# EAGLE design WS2801-Breakout-v11 (EAGLE 5.11)
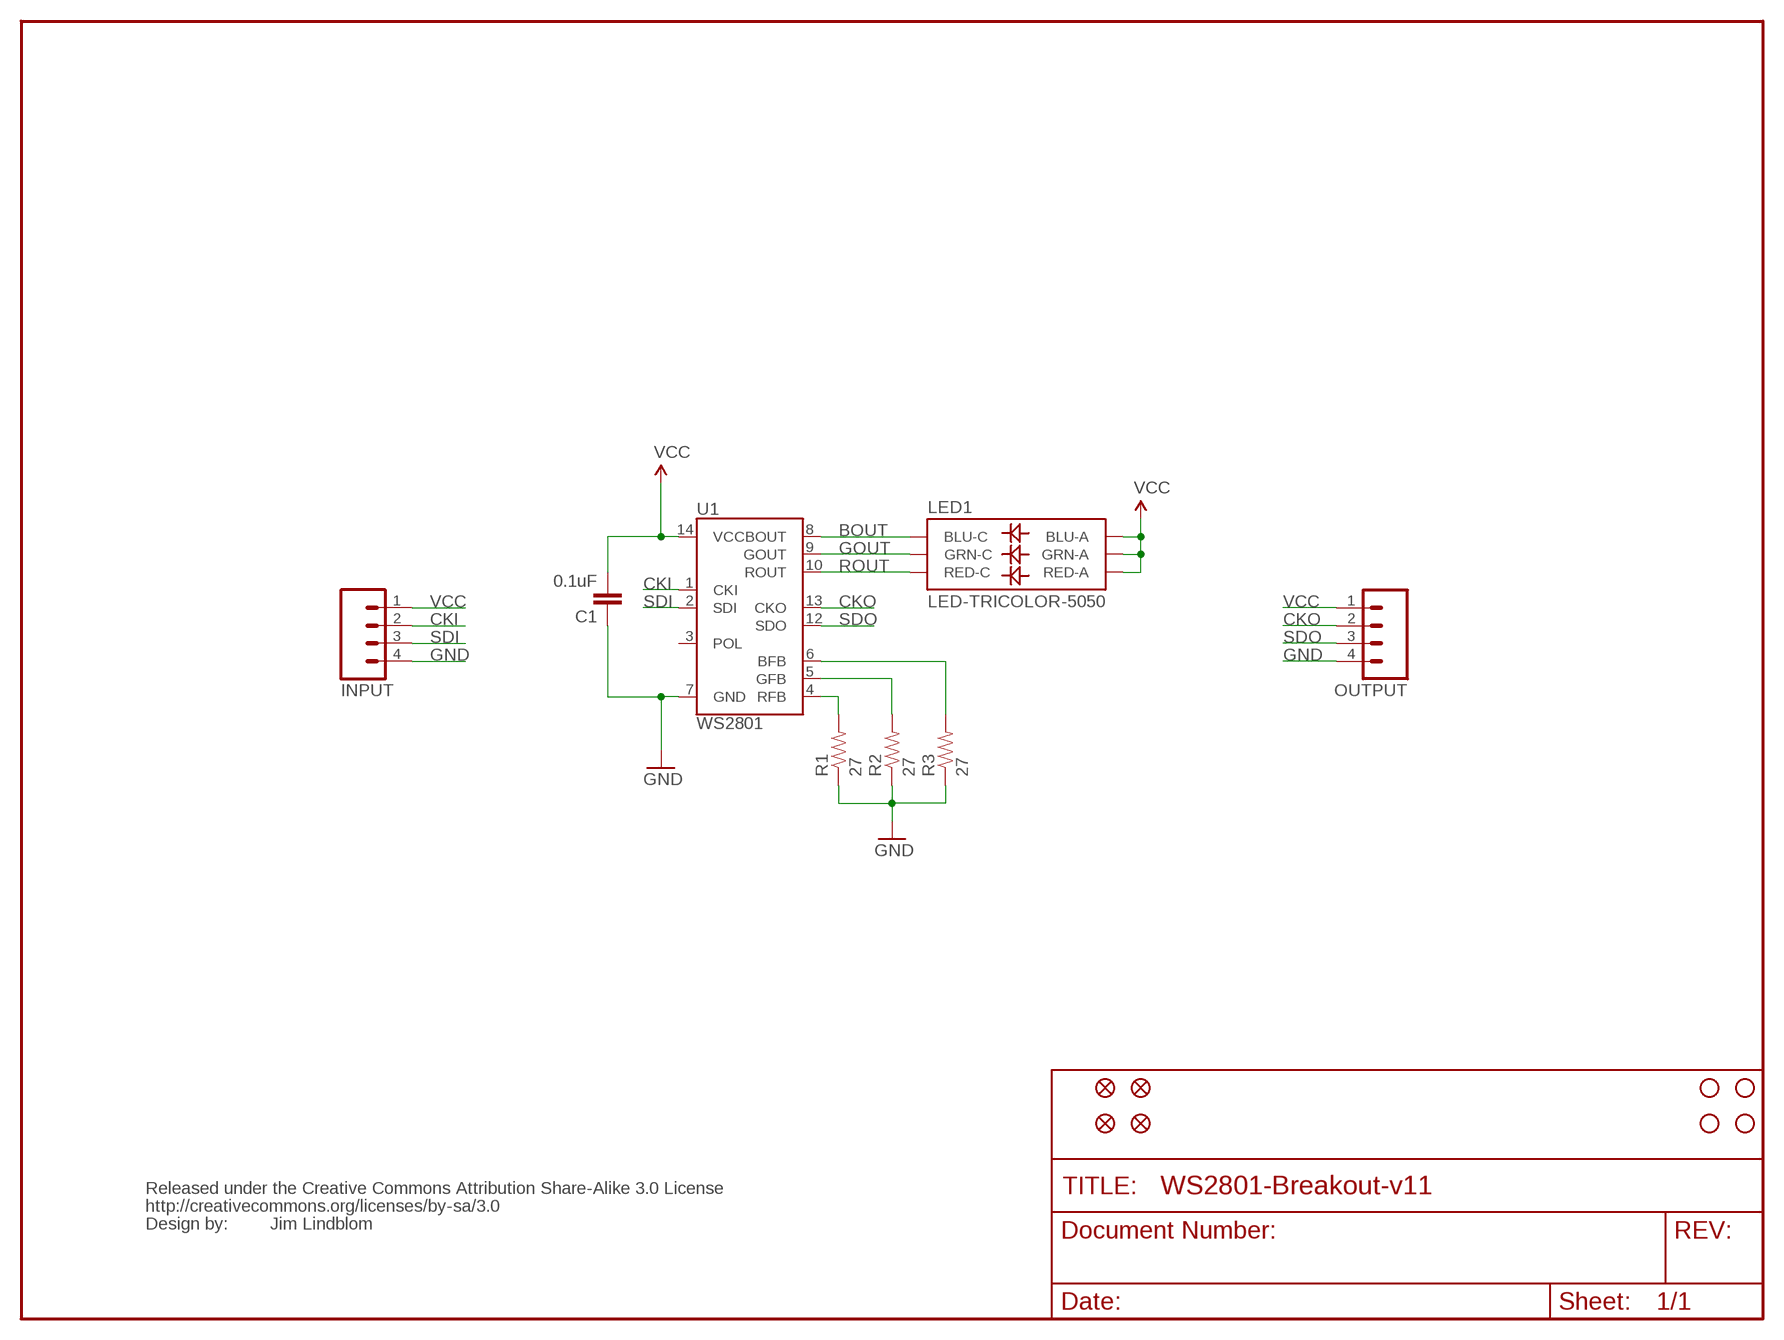
[diagram p0: schematic, sheet 1]

## Parts
C1  0.1uF  CAP0402-CAP  [0402-CAP]
INPUT  M04PTH  [1X04]
JP1  STAND-OFF  [STAND-OFF]
JP2  STAND-OFF  [STAND-OFF]
JP4  STAND-OFF  [STAND-OFF]
JP5  STAND-OFF  [STAND-OFF]
JP6  FIDUCIAL1X2  [FIDUCIAL-1X2]
JP7  FIDUCIAL1X2  [FIDUCIAL-1X2]
JP8  FIDUCIAL1X2  [FIDUCIAL-1X2]
JP9  FIDUCIAL1X2  [FIDUCIAL-1X2]
LED1  LED-TRICOLOR-5050  [LED-TRICOLOR-5050]
OUTPUT  M04PTH  [1X04]
R1  27  RESISTOR0402-RES  [0402-RES]
R2  27  RESISTOR0402-RES  [0402-RES]
R3  27  RESISTOR0402-RES  [0402-RES]
U1  WS2801  [SOP-14]
U$1  CREATIVE_COMMONS  [CREATIVE_COMMONS]

## Nets
BFB: R3.2 U1.6(BFB)
BOUT: LED1.4(BLU-C) U1.8(BOUT)
CKI: INPUT.2 U1.1(CKI)
CKO: OUTPUT.2 U1.13(CKO)
GFB: R2.2 U1.5(GFB)
GND: C1.1 INPUT.4 OUTPUT.4 R1.1 R2.1 R3.1 U1.7(GND)
GOUT: LED1.6(GRN-C) U1.9(GOUT)
RFB: R1.2 U1.4(RFB)
ROUT: LED1.5(RED-C) U1.10(ROUT)
SDI: INPUT.3 U1.2(SDI)
SDO: OUTPUT.3 U1.12(SDO)
VCC: C1.2 INPUT.1 LED1.1(GRN-A) LED1.2(RED-A) LED1.3(BLU-A) OUTPUT.1 U1.14(VCC)
Unconnected: U1.3(POL)

## Notes on the sheet
- Jim Lindblom

## Library data of the parts
C1 = SparkFun:CAP: Capacitor Standard 0603 ceramic capacitor, and 0.1" leaded capacitor.
INPUT OUTPUT = SparkFun:M04: Header 4 Standard 4-pin 0.1" header. Use with straight break away headers (SKU : PRT-00116), right angle break away headers (PRT-00553), swiss pins (PRT-00743), machine pins (PRT-00117), and female headers (PRT-00115). Molex polarized connector foot print use with SKU : PRT-08231 with associated crimp pins and housings. 1MM SMD Version SKU: PRT-10208
JP1 JP2 JP4 JP5 = SparkFun:STAND-OFF: Stand Off This is the mechanical footprint for a #4 phillips button head screw. Use the keepout ring to avoid running the screw head into surrounding components. SKU : PRT-00447
JP6-JP9 = SparkFun:FIDUCIAL: Fiducial Alignment Points Various fiducial points for machine vision alignment.
LED1 = SparkFun:LED-TRICOLOR-5050
R1-R3 = SparkFun:RESISTOR: Resistor Basic schematic elements and footprints for 0603, 1206, and PTH resistors.
U1 = SparkFun:WS2801: WS2801 3 Channel Constant Current LED Driver with programmable PWM outputs. Datasheet: http://www.sparkfun.com/datasheets/Components/LED/WS2801.pdf
U$1 = SparkFun:CREATIVE_COMMONS

## Board
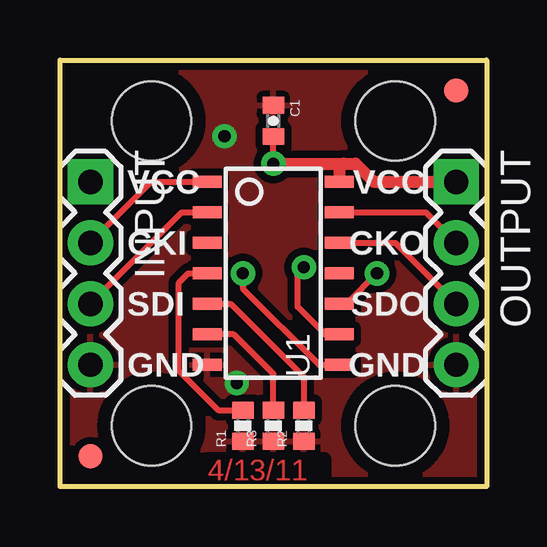
[diagram p1: board, top side]
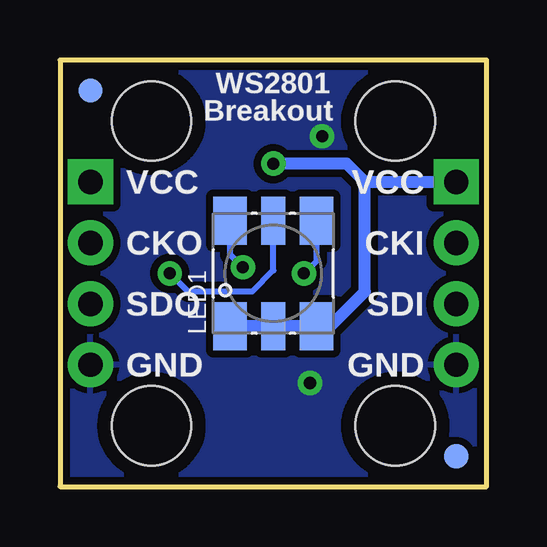
[diagram p2: board, bottom side, seen from below]

Size 17.78 x 17.78 mm. Coordinates in mm from the lower left corner, seen from the top.
Outline: 0,0 0,17.78 17.78,17.78 17.78,0 0,0
Copper layers (1*16): Top 0.035mm / dielectric 1.5mm / Bottom 0.035mm
Design rules "SparkFun *": minimum track width 8mil, minimum drill 20mil, track to track 8mil, track to pad 8mil, pad to pad 8mil, via to via 8mil, smd to smd 8mil, copper to edge 8mil, drill to drill 8mil, minimum pad ring 12mil, minimum via ring 10mil, stop-mask expansion 4mil, vias tented up to drill 20mil, thermal gap 10mil

### Footprints (pad centres in the part's own frame; a part is rotated, then mirrored left to right if it is on the bottom)
0402-CAP = smd 0.7 x 0.9: 1 -0.65,0; 2 0.65,0
1X04 = drill 1.016 pad 1.88 square: 1 0,0 | drill 1.016 pad 1.88 round: 2 2.54,0; 3 5.08,0; 4 7.62,0
STAND-OFF = hole 3.302: 0,0
FIDUCIAL-1X2 = smd 1 x 1: 1 0,0
LED-TRICOLOR-5050 = smd 2 x 1.4: 1 -2.2,1.8; 3 -2.2,-1.8; 4 2.2,-1.8; 6 2.2,1.8 | smd 2 x 1: 2 -2.2,0; 5 2.2,0
0402-RES = smd 0.7 x 0.9: 1 -0.65,0; 2 0.65,0
SOP-14 = smd 0.5 x 1.2: 1 -3.81,-2.75; 2 -2.54,-2.75; 3 -1.27,-2.75; 4 0,-2.75; 5 1.27,-2.75; 6 2.54,-2.75; 7 3.81,-2.75; 8 3.81,2.75; 9 2.54,2.75; 10 1.27,2.75; 11 0,2.75; 12 -1.27,2.75; 13 -2.54,2.75; 14 -3.81,2.75

### Placement (x,y rotation side)
C1  8.89,15.24 270 top
INPUT  1.27,12.7 270 top
JP1  13.97,15.24 0 top
JP2  3.81,2.54 0 top
JP4  3.81,15.24 0 top
JP5  13.97,2.54 0 top
JP6  16.51,16.51 0 top
JP7  1.27,1.27 0 top
JP8  1.27,1.27 0 bottom
JP9  16.51,16.51 0 bottom
LED1  8.89,8.89 90 bottom
OUTPUT  16.51,12.7 270 top
R1  7.62,2.54 90 top
R2  10.16,2.54 90 top
R3  8.89,2.54 90 top
U1  8.89,8.89 270 top
U$1  -13.97,-8.89 0 top  (outside the outline)

### Tracks (layer width: path | path; a pad name or v marks a point on that pad's centre or on a via)
BFB
  Top 0.254: R3.2 8.89,4.7 7.24,6.35 U1.6
BOUT  (via drill 0.51)
  Top 0.254: U1.8 10.79,5.08 7.62,8.26 v7.62,8.89
  Bottom 0.254: LED1.4 7.09,9.42 v7.62,8.89
CKI
  Top 0.254: U1.1 3.81,12.7 INPUT.2
CKO
  Top 0.254: U1.13 15.24,11.43 OUTPUT.2
GFB
  Top 0.254: U1.5 7.11,7.62 10.16,4.57 R2.2
GND  (via drill 0.51)
  other vias: 6.86,14.61 7.37,4.32
  pour Top (isolate 0.305): 0,17.78 0,0 17.78,0 17.78,17.78
  pour Bottom (isolate 0.305): 0,17.78 0,0 17.78,0 17.78,17.78
GOUT  (via drill 0.51)
  Top 0.254: U1.9 11.05,6.35 9.91,7.49 9.91,8.89 v10.16,9.14
  Bottom 0.254: LED1.6 10.69,9.67 v10.16,9.14
RFB
  Top 0.254: U1.4 5.33,8.89 4.95,8.51 4.95,4.83 6.59,3.19 R1.2
ROUT  (via drill 0.51)
  Top 0.254: U1.10 11.64,7.66 11.98,7.66 v13.21,8.89
  Bottom 0.254: LED1.5 8.89,9.02 9.78,8.13 12.45,8.13 v13.21,8.89
SDI
  Top 0.254: U1.2 5.08,11.43 INPUT.3
SDO
  Top 0.254: U1.12 13.97,10.16 OUTPUT.3
VCC  (via drill 0.51)
  Top 0.254: v8.89,13.46 C1.2
  Top 0.508: 11.81,13.46 12.32,13.46 13.08,12.7 OUTPUT.1 | U1.14 11.64,13.29 11.81,13.46 | v8.89,13.46 11.81,13.46
  Bottom 0.508: v8.89,13.46 5.84,13.46 5.08,12.7 | 5.08,12.7 INPUT.1 | 5.08,12.7 5.08,8.13 6.52,6.69 LED1.3 LED1.2 | LED1.2 LED1.1 LED1.2

### Text on the board
Top: 4/13/11
tPlace: VCC | VCC | CKO | CKI | SDO | SDI | GND | GND
bPlace: WS2801 | Breakout | VCC | VCC | CKI | CKO | SDI | SDO | GND | GND